# Altium schematic sheet Inverters, drives.SchDoc: Inverters, drivers
size A4; Author: Schuszter André; DrawnBy: Schuszter André; Revision: A
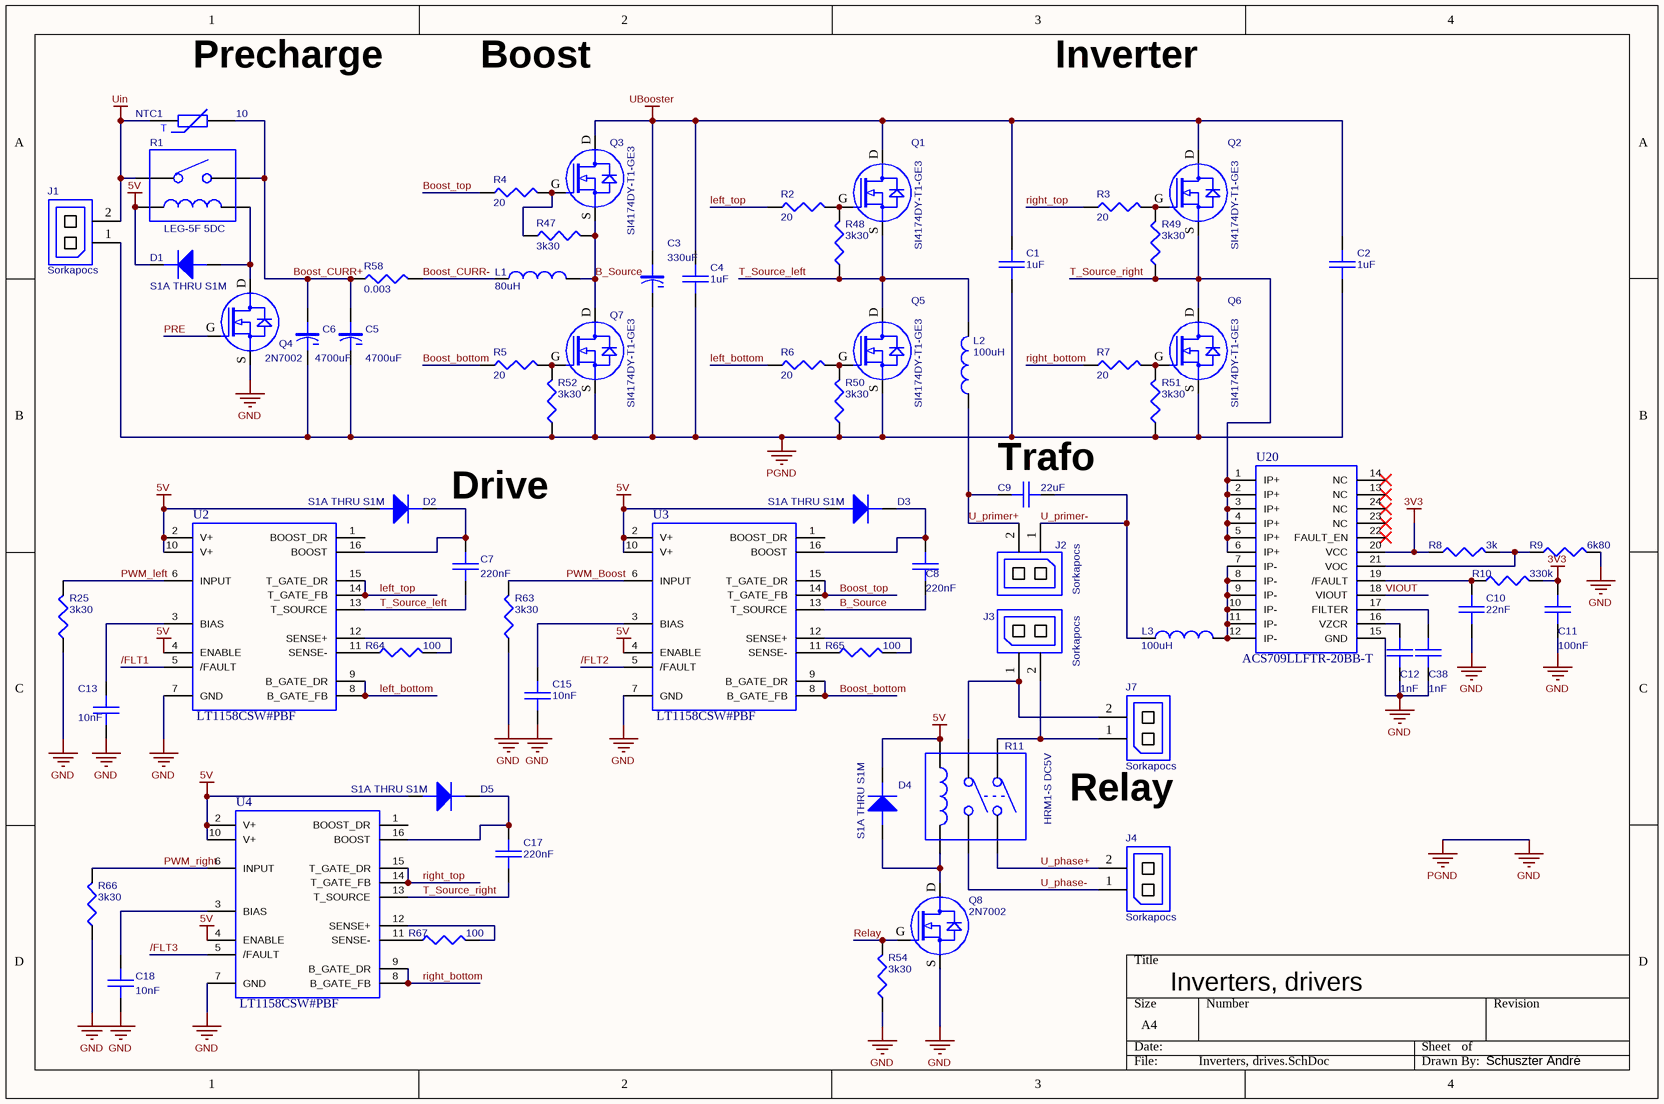
[diagram p0: Inverters, drives.SchDoc]

## Parts
C1  1uF  [CAPC3216X07N]
C2  1uF  [CAPC3216X07N]
C3  330uF  [CAPAE116103X105N]
C4  1uF  [CAPC3216X07N]
C5  4700uF  [CAPAE189170X165N]
C6  4700uF  [CAPAE189170X165N]
C7  220nF  [CAPC2012X06N]
C8  220nF  [CAPC2012X06N]
C9  22uF  [MKS4D052206F00KYSD]
C10  22nF  [CAPC2012X06N]
C11  100nF  [CAPC2012X06N]
C12  1nF  [CAPC2012X06N]
C13  10nF  [CAPC2012X06N]
C15  10nF  [CAPC2012X06N]
C17  220nF  [CAPC2012X06N]
C18  10nF  [CAPC2012X06N]
C38  1nF  [CAPC2012X06N]
D1  S1A THRU S1M  [DIOM4436X25N]
D2  S1A THRU S1M  [DIOM4436X25N]
D3  S1A THRU S1M  [DIOM4436X25N]
D4  S1A THRU S1M  [DIOM4436X25N]
D5  S1A THRU S1M  [DIOM4436X25N]
J1  Sorkapocs  [sorkapocs]
J2  Sorkapocs  [sorkapocs]
J3  Sorkapocs  [sorkapocs]
J4  Sorkapocs  [sorkapocs]
J7  Sorkapocs  [sorkapocs]
L1  80uH  [IND_160uH]
L2  100uH  [IND_160uH]
L3  100uH  [IND_160uH]
NTC1  10  [NTC]
Q1  SI4174DY-T1-GE3  [SOIC8-InvFet]
Q2  SI4174DY-T1-GE3  [SOIC8-InvFet]
Q3  SI4174DY-T1-GE3  [SOIC8-InvFet]
Q4  2N7002  [SOT95P240X111_SGD-3N]
Q5  SI4174DY-T1-GE3  [SOIC8-InvFet]
Q6  SI4174DY-T1-GE3  [SOIC8-InvFet]
Q7  SI4174DY-T1-GE3  [SOIC8-InvFet]
Q8  2N7002  [SOT95P240X111_SGD-3N]
R1  LEG-5F 5DC  [relay_1]
R2  20  [RESC2012X06N]
R3  20  [RESC2012X06N]
R4  20  [RESC2012X06N]
R5  20  [RESC2012X06N]
R6  20  [RESC2012X06N]
R7  20  [RESC2012X06N]
R8  3k  [RESC2012X06N]
R9  6k80  [RESC2012X06N]
R10  330k  [RESC2012X06N]
R11  HRM1-S DC5V  [relay]
R25  3k30  [RESC2012X06N]
R47  3k30  [RESC2012X06N]
R48  3k30  [RESC2012X06N]
R49  3k30  [RESC2012X06N]
R50  3k30  [RESC2012X06N]
R51  3k30  [RESC2012X06N]
R52  3k30  [RESC2012X06N]
R54  3k30  [RESC2012X06N]
R58  0.003  [RESC6432X07N]
R63  3k30  [RESC2012X06N]
R64  100  [RESC2012X06N]
R65  100  [RESC2012X06N]
R66  3k30  [RESC2012X06N]
R67  100  [RESC2012X06N]
U2  LT1158CSW#PBF  [SOIC127P1060X265-16N]
U3  LT1158CSW#PBF  [SOIC127P1060X265-16N]
U4  LT1158CSW#PBF  [SOIC127P1060X265-16N]
U20  ACS709LLFTR-20BB-T  [SOP64P600X175-24N]

## Nets
3V3: C11.1 R8.1 R10.2 U20.20(VCC)
5V: D1.C(CATHODE) D2.A(ANODE) D3.A(ANODE) D4.C(CATHODE) D5.A(ANODE) R1.1(VCC) R11.1(VCC) U2.2(V+) U2.4(ENABLE) U2.10(V+) U3.2(V+) U3.4(ENABLE) U3.10(V+) U4.2(V+) U4.4(ENABLE) U4.10(V+)
GND: C1.2 C2.2 C3.2(N) C4.2 C5.2(N) C6.2(N) C10.2 C11.2 C12.2 C13.2 C15.2 C18.2 C38.2 J1.1(P1) Q4.S Q5.S Q6.S Q7.S Q8.S R9.2 R25.1 R50.1 R51.1 R52.1 R54.1 R63.1 R66.1 U2.7(GND) U3.7(GND) U4.7(GND) U20.15(GND)  [also labelled PGND]
UBooster: C1.1 C2.1 C3.1(P) C4.1 Q1.D Q2.D Q3.D
Uin: J1.2(P2) NTC1.1 R1.3
/FLT1: U2.5(/FAULT)
/FLT2: U3.5(/FAULT)
/FLT3: U4.5(/FAULT)
B_Source: C8.2 L1.2 Q3.S Q7.D R47.2 U3.13(T_SOURCE)
Boost_bottom: R5.1 U3.8(B_GATE_FB) U3.9(B_GATE_DR)
Boost_CURR+: C5.1(P) C6.1(P) NTC1.2 R1.4 R58.1
Boost_CURR-: L1.1 R58.2
Boost_top: R4.1 U3.14(T_GATE_FB) U3.15(T_GATE_DR)
left_bottom: R6.1 U2.8(B_GATE_FB) U2.9(B_GATE_DR)
left_top: R2.1 U2.14(T_GATE_FB) U2.15(T_GATE_DR)
PRE: Q4.G
PWM_Boost: R63.2 U3.6(INPUT)
PWM_left: R25.2 U2.6(INPUT)
PWM_right: R66.2 U4.6(INPUT)
Relay: Q8.G R54.2
right_bottom: R7.1 U4.8(B_GATE_FB) U4.9(B_GATE_DR)
right_top: R3.1 U4.14(T_GATE_FB) U4.15(T_GATE_DR)
T_Source_left: C7.2 L2.2 Q1.S Q5.D R48.1 U2.13(T_SOURCE)
T_Source_right: C17.2 Q2.S Q6.D R49.1 U4.13(T_SOURCE) U20.1(IP+) U20.2(IP+) U20.3(IP+) U20.4(IP+) U20.5(IP+) U20.6(IP+)
U_phase+: J4.2(P2) R11.6
U_phase-: J4.1(P1) R11.4
U_primer+: C9.1 J2.2(P2) L2.1
U_primer-: C9.2 J2.1(P1) L3.1
VIOUT: U20.18(VIOUT)
NetC7_1: C7.1 D2.C(CATHODE) U2.16(BOOST)
NetC8_1: C8.1 D3.C(CATHODE) U3.16(BOOST)
NetC10_1: C10.1 R10.1 U20.19(/FAULT)
NetC12_1: C12.1 U20.16(VZCR)
NetC13_1: C13.1 U2.3(BIAS)
NetC15_1: C15.1 U3.3(BIAS)
NetC17_1: C17.1 D5.C(CATHODE) U4.16(BOOST)
NetC18_1: C18.1 U4.3(BIAS)
NetC38_1: C38.1 U20.17(FILTER)
NetD1_A: D1.A(ANODE) Q4.D R1.2(GND)
NetD4_A: D4.A(ANODE) Q8.D R11.2(GND)
NetJ3_1: J3.1(P1) J7.2(P2) R11.3
NetJ3_2: J3.2(P2) J7.1(P1) R11.5
NetL3_2: L3.2 U20.7(IP-) U20.8(IP-) U20.9(IP-) U20.10(IP-) U20.11(IP-) U20.12(IP-)
NetQ1_G: Q1.G R2.2 R48.2
NetQ2_G: Q2.G R3.2 R49.2
NetQ3_G: Q3.G R4.2 R47.1
NetQ5_G: Q5.G R6.2 R50.2
NetQ6_G: Q6.G R7.2 R51.2
NetQ7_G: Q7.G R5.2 R52.2
NetR8_2: R8.2 R9.1 U20.21(VOC)
NetR64_1: R64.1 U2.11(SENSE-)
NetR64_2: R64.2 U2.12(SENSE+)
NetR65_1: R65.1 U3.11(SENSE-)
NetR65_2: R65.2 U3.12(SENSE+)
NetR67_1: R67.1 U4.11(SENSE-)
NetR67_2: R67.2 U4.12(SENSE+)

Not connected (* = marked no-connect by the designer): U2 1(BOOST_DR); U3 1(BOOST_DR); U4 1(BOOST_DR); U20 13(NC)* 14(NC)* 22(FAULT_EN)* 23(NC)* 24(NC)*

## Notes on the sheet
- (near NTC1) Precharge
- Boost
- Inverter
- (near C9) Trafo
- Drive
- (near J7) Relay
- (in symbol NTC) T

## Library data of the parts
C1 C2 = Csnubber: 2495497; Part number: 0805F105Z500CT; Supplier: Farnell; Code: 2495497
C3 = CAPAE: 2611390; Part number: MCVVT035M331GB3L; Supplier: Farnell; Code: 2611390
C4 = Csnubber: 2495497; Part number: GRM31CR6YA106KA12L; Supplier: Farnell; Code: 2495497
C5 C6 = CAPAE: 2326365; Part number: EEVFK1C472M; Supplier: Farnell; Code: 2326365
C7 C8 C17 = CAPC: 82-03-85
C9 = CAPC: 07-06-83; Part number: 22uF 100V RM27.5 10% FOL MKS4 MKS4D052206F00KYSD (WIM) 15x26x31.5mm; Supplier: Lomex; Code: 07-06-83
C10 = CAPC: 82-00-77
C11 = CAPC: 82-07-32
C12 C38 = CAPC: 82-00-75
C13 C15 C18 = CAPC: 82-05-66
D1-D5 = RELÉ_DIO: 83-02-64; Part number: 1A 1000V DO-214AC RECT. S1M (YET) SMA; Supplier: Lomex; Code: 83-02-64
J1-J4 J7 = Sorkapocs: 43-07-92; Part number: SORKAPOCS 2 P RM5.08 CLL5.08/2 (STE) h=13.8mm LIFT.2.5mmř 24A; Supplier: Lomex; Code: 43-07-92
L1-L3 = IND
NTC1 = NTC: 1688795; Part number: B57153S0100M000; Supplier: Farnell; Code: 1688795
Q1-Q3 Q5-Q7 = INVERTER_NFET: 1840422; Part number: SI4174DY-T1-GE3; Supplier: Farnell; Code: 1840422
Q4 Q8 = RELÉ_NFET: 86-00-97; Part number: 2N7002 (NXP) N-FET 60V 0.3A 0.83W Rds>5R SOT-23 ˝12W˝ (SN7002); Supplier: Lomex; Code: 86-00-97
R1 = RELÉ_1CSAT: 42-02-61; Part number: LEG-5F 5DC (RAY) 70R; Supplier: Lomex; Code: 42-02-61
R2-R7 = RES_US_HOR: 81-11-96
R8 = RES_US_HOR: 81-16-68
R9 = RES_US_HOR: 81-10-97
R10 = RES_US_HOR: 80-15-29
R11 = RELÉ: 9479937; Supplier: Farnell; Code: 9479937; Part number: HRM1-S DC5V
R25 R47-R52 R54 R63 R66 = RES_US_HOR: 81-10-93
R58 = RES_US_HOR: 2356700; Part number: ERJ-M1WTF3M0U; Supplier: Farnell; Code: 2356700
R64 R65 R67 = RES_US_HOR: 81-10-75
U2-U4 = meghajtó: 1273473; Supplier: Farnell; Part number: LT1158CSW#PBF; Code: 1273473
U20 = árammérő: Code: 1858083; Supplier: Farnell; Part number: ACS709LLFTR-20BB-T